# EasyEDA Pro project Project.eprj, board PCB10
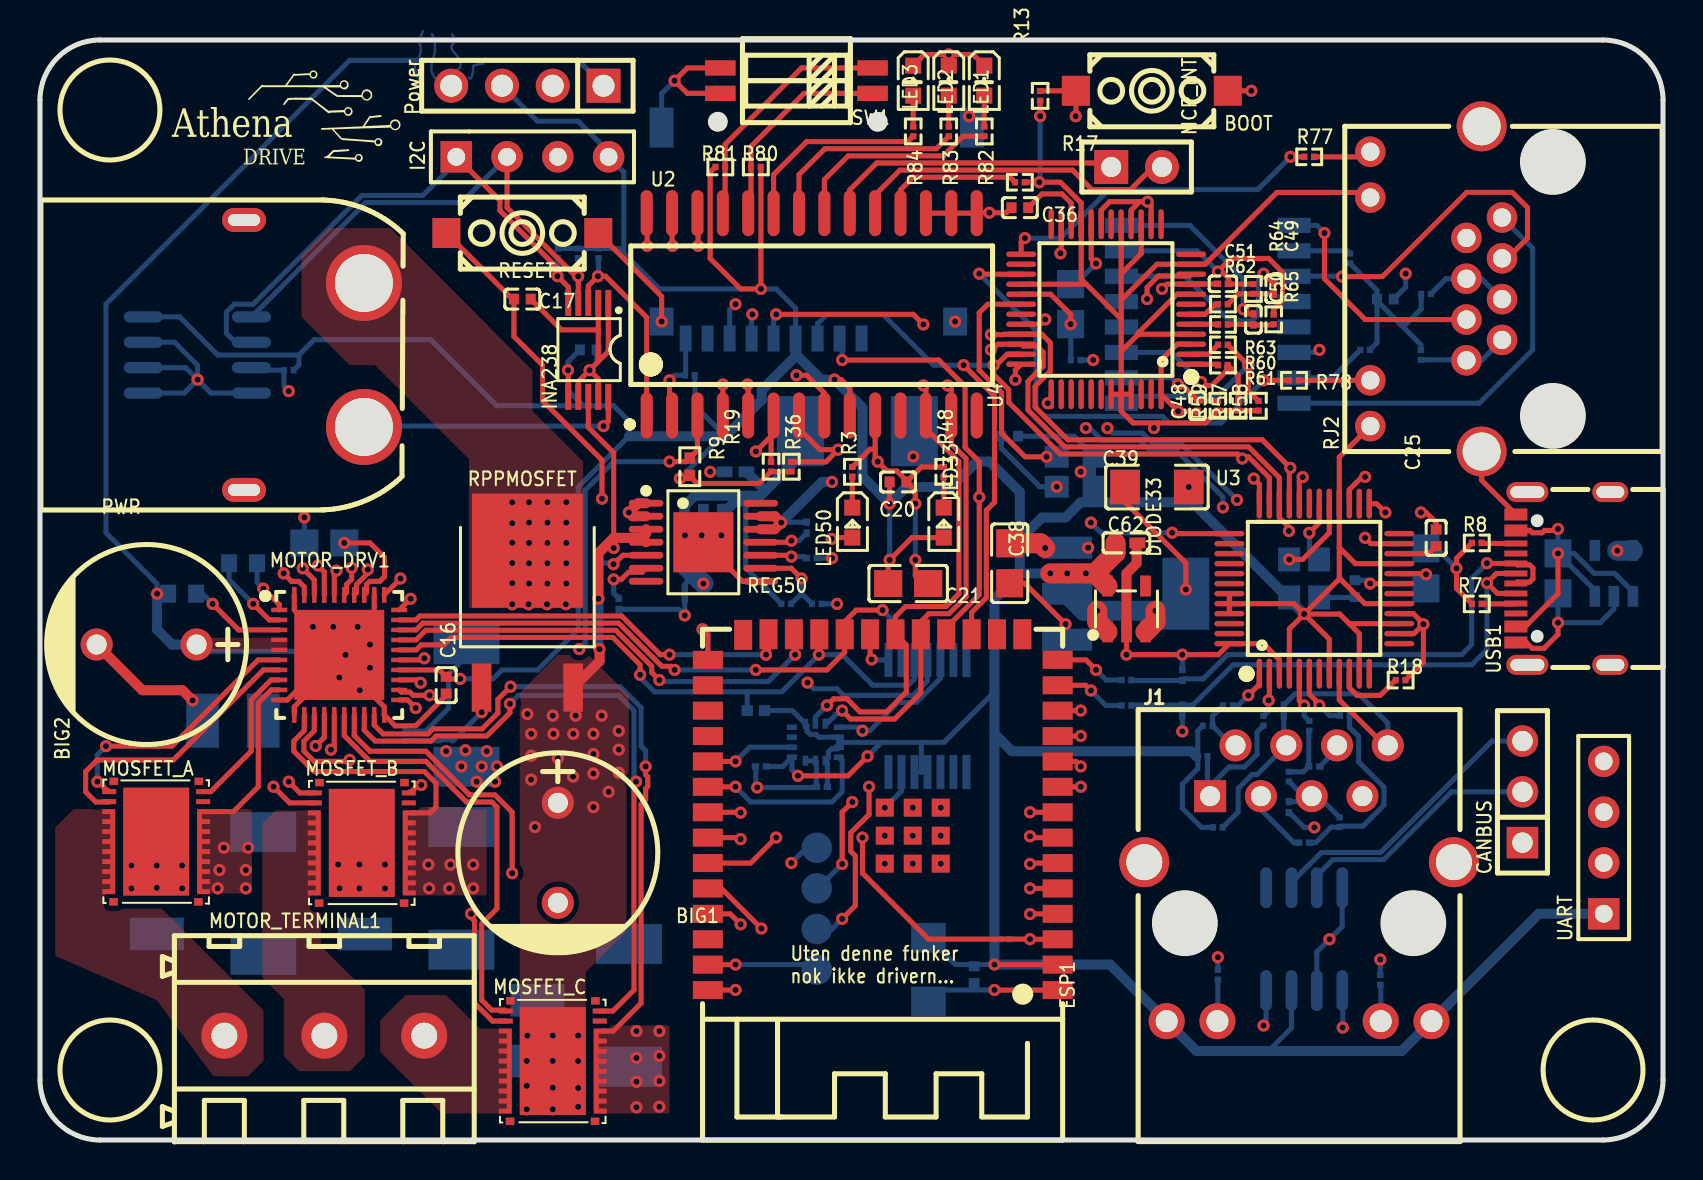
[diagram p7: board, top side]
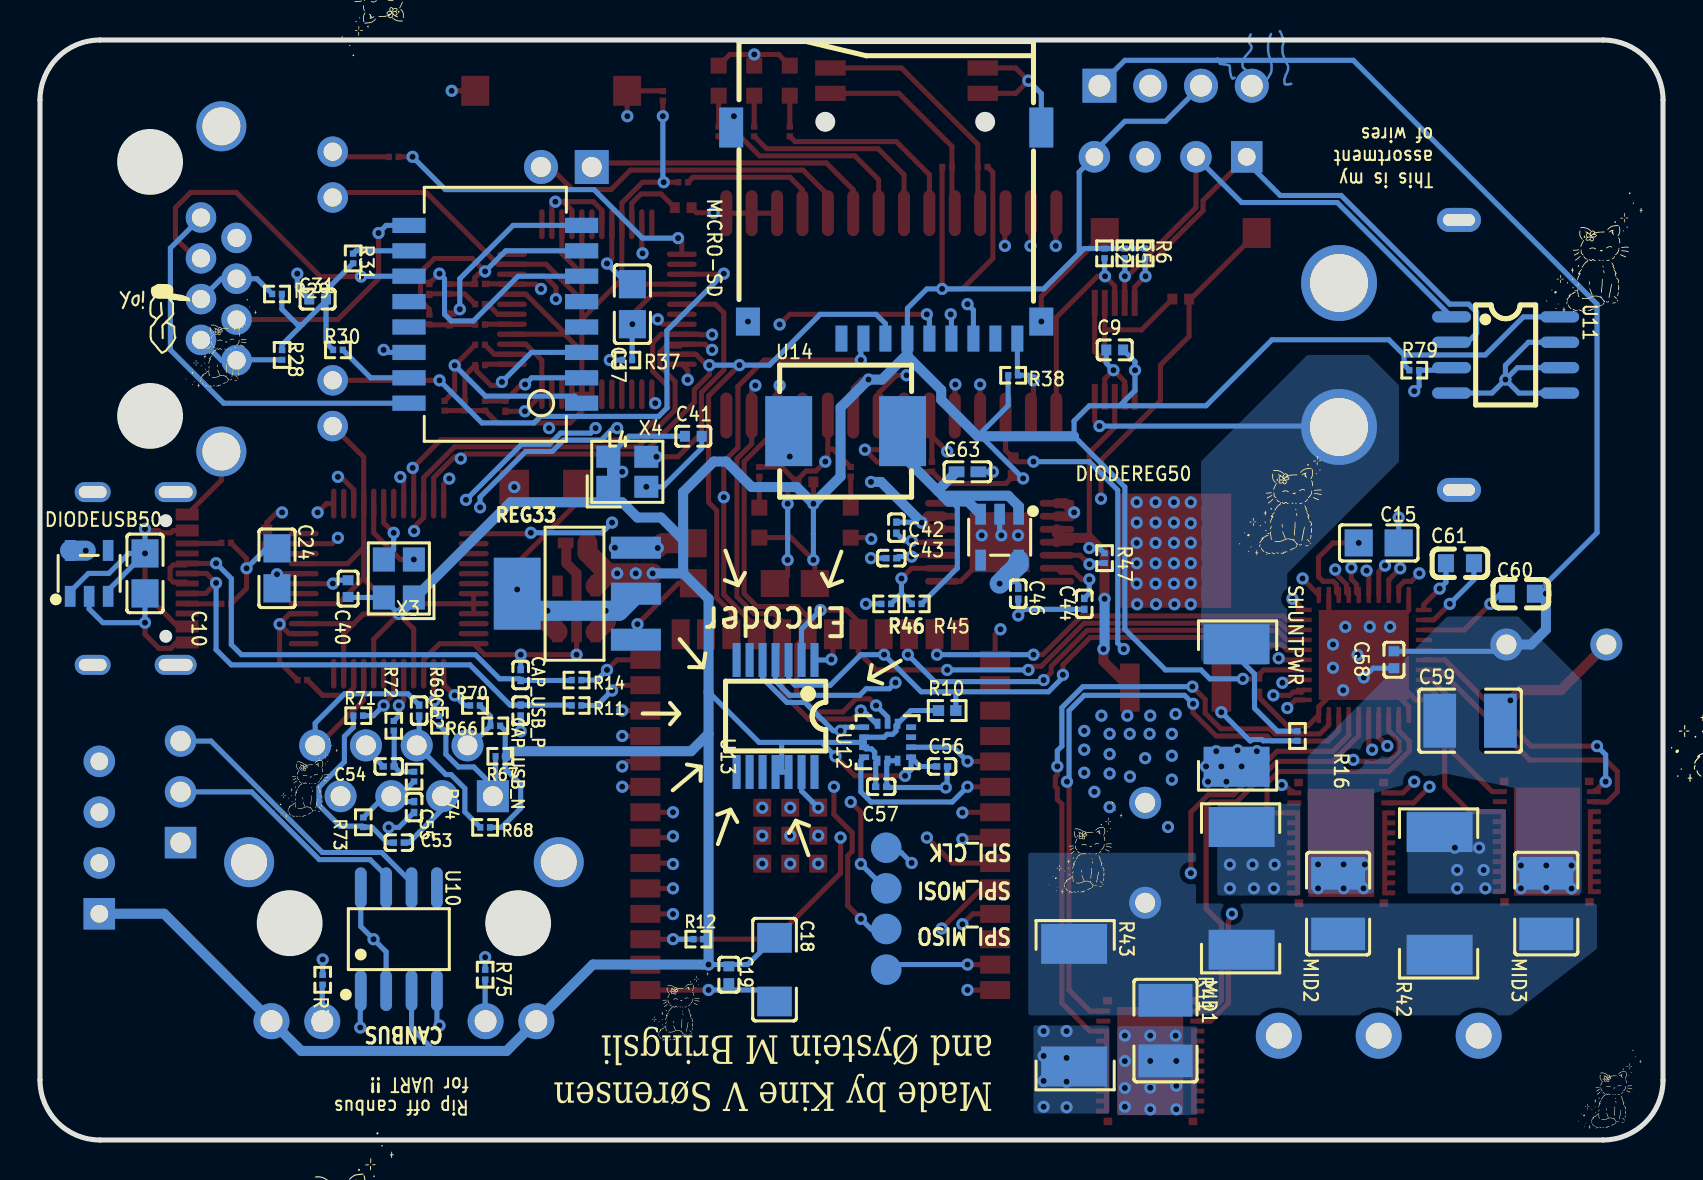
[diagram p8: board, bottom side, seen from below]

Outline 81.2 x 55 mm; copper layers: Top Layer, Inner1, Inner2, Bottom Layer. Coordinates in mm from the lower left corner of the outline.
Outline path: 0,52 0,3 arc(0.88,0.88) 3,0 78.2,0 arc(80.32,0.88) 81.2,3 81.2,52 arc(80.32,54.12) 78.2,55 3,55 arc(0.88,54.12) 0,52
Stack: Top Layer 0.035mm Outer layer thickness 1oz / Dielectric1 0.2104mm 7628 RC49% 8.6mil / Inner1 0.0152mm Inner layer thickness / Dielectric2 1.065mm 1.1mm H/HOZ Copper / Inner2 0.0152mm Inner layer thickness / Dielectric3 0.2104mm 7628 RC49% 8.6mil / Bottom Layer 0.035mm Outer layer thickness 1oz

## Design rules (mm)
template: Custom Config
spacing copperThickness1oz (default): track to track 0.102, other pairs 0.152 to 0.3
spacing copperThickness2oz: track to track 0.203, other pairs 0.152 to 0.3
track width copperThickness1oz (default): min 0.127, default 0.254, max 2.54
track width copperThickness2oz: min 0.203, default 0.254, max 2.54
differential pair differentialPair (default): width min 0.127, default 0.254, max 2.54; gap min 0.152, default 0.152
via viaSize (default): diameter min 0.5, default 0.61, max 10; hole min 0.3, default 0.305, max 6.3
net GND uses copperRegion1
net VIN uses copperRegion1
net $1N21 uses copperRegion1
net $2N31 uses copperRegion1
net $2N36 uses copperRegion1
net $2N29 uses copperRegion1
net $2N24 uses copperRegion1
net $1N52 uses copperRegion1
net $2N4941 uses copperRegion1
net $2N4957 uses copperRegion1

## Placement (name value [footprint] x y rotation side)
BIG1  470uF  [CAP-TH_BD10.0-P5.00-D0.6-FD_2]  25.91 14.36 270 top
BIG2  470uF  [CAP-TH_BD10.0-P5.00-D0.6-FD_2]  5.33 24.77 180 top
BOOT  K2-3.6×6.1_SMD  [KEY-SMD_2P-L6.2-W3.6-LS8.0]  55.63 52.46 0 top
C9  0.1uF  [C0402#2]  27.43 39.51 180 bottom
C10  4.7uF  [C0805]  75.95 28.33 90 bottom
C15  1u  [C0805]  14.22 29.85 180 bottom
C16  0.1uF  [C0402#2]  20.32 22.74 90 top
C17  0.1uF  [C0402#2]  24.13 42.05 180 top
C18  22uF  [C1206]  44.45 8.52 90 bottom
C19  0.1uF  [C0402#2]  46.74 8.26 90 bottom
C20  0.1uF  [C0402#2]  42.93 32.9 180 top
C21  10uF  [C0805]  43.43 27.82 180 top
C24  4.7uF  [C0805]  69.34 28.58 270 bottom
C25  10nF  [C0402#2]  69.85 30.11 270 top
C31  1000pF  [C0402#2]  67.31 42.05 180 bottom
C36  10nF  [C0402#2]  49.02 46.62 0 top
C37  4.7uF  [C0805]  51.56 41.79 90 bottom
C38  10uF  [C0805]  48.51 28.84 90 top
C39  22uF  [C1206]  55.88 32.65 0 top
C40  0.01uF  [C0402#2]  65.79 27.57 90 bottom
C41  0.01uF  [C0402#2]  48.51 35.19 180 bottom
C42  100nF  [C0201]  38.35 30.62 270 bottom
C43  100nF  [C0201]  38.61 29.09 180 bottom
C44  10nF  [C0201]  28.96 26.81 270 bottom
C46  100nF  [C0201]  32.26 27.31 270 bottom
C48  22nF  [C0201]  57.91 36.71 270 top
C49  6.8nF  [C0201]  61.72 42.55 270 top
C50  6.8nF  [C0201]  60.71 41.03 270 top
C51  10nF  [C0201]  59.18 42.81 180 top
C52  22nF  [C0201]  62.23 21.47 90 bottom
C53  6.8nF  [C0201]  63.25 14.87 0 bottom
C54  6.8nF  [C0201]  63.75 18.68 180 bottom
C55  10nF  [C0201]  62.48 16.65 270 bottom
C56  100nF  [C0201]  36.07 18.68 180 bottom
C57  100nF  [C0201]  39.12 17.66 180 bottom
C58  100nF  [C0402#2]  13.46 24.01 270 bottom
C59  10uF  [C1210]  9.65 20.96 180 bottom
C60  1uF  [C0603]  7.11 27.31 0 bottom
C61  47nF  [C0603]  10.16 28.84 180 bottom
C62  15uF  [C0402]  54.36 29.85 0 top
C63  15uF  [C0402]  34.8 33.41 180 bottom
CANBUS  -  [HDR-TH_3P-P2.54-V-F]  74.17 17.41 90 top
CAP_USB_N  NC  [C0201]  57.15 21.47 90 bottom
CAP_USB_P  NC  [C0201]  57.15 23.25 270 bottom
DIODE33  MAX40200AUK+T  [TSOT-23-5_L2.9-W1.6-P0.95-LS2.8-BL]  54.36 26.55 0 top
DIODEREG50  MAX40200AUK+T  [TSOT-23-5_L2.9-W1.6-P0.95-LS2.8-BL]  33.19 30.14 0 bottom
DIODEUSB50  MAX40200AUK+T  [TSOT-23-5_L2.9-W1.6-P0.95-LS2.8-BL]  78.74 28.33 180 bottom
ESP1  ESP32-S3-WROOM-1(N16R8)  [WIRELM-SMD_ESP32-S3-WROOM-1]  42.16 16.39 180 top
I2C  HDR-F-2.54_1x4  [HDR-F-2.54_1X4]  24.64 49.16 0 top
INA238  INA238AIDGSR  [VSSOP-10_L3.0-W3.0-P0.50-LS4.9-BL]  27.43 39.51 180 top
J1  HR911105A  [RJ45-TH_HR911105A]  62.99 12.84 0 top
L4  HX1188NLT  [RJ45-SMD_HX1188NLT]  58.42 41.28 0 bottom
LED1  KT-0603Y  [LED0603-R-RD]  45.47 52.97 270 top
LED2  KT-0603Y  [LED0603-R-RD]  47.24 52.97 270 top
LED3  KT-0603Y  [LED0603-R-RD]  43.69 52.97 270 top
LED33  KT-0603YG  [LED0603-RD]  45.21 30.87 270 top
LED50  KT-0603YG  [LED0603-RD]  40.64 30.87 270 top
MCP_INT  -  [HDR-TH_2P-P2.54-V-F]  54.86 48.65 0 top
MICRO-SD  TF-01A  [TF-SMD_TF-01A]  38.86 45.35 0 bottom
MID1  10uF  [C1210]  24.89 5.47 270 bottom
MID2  10uF  [C1210]  16.26 11.82 90 bottom
MID3  10uF  [C1210]  5.84 11.82 90 bottom
MOSFET_A  CSD88599Q5DC  [SON-22_L5.0-W6.0-P0.50-CSD88599Q5DCT]  5.81 14.92 0 top
MOSFET_B  CSD88599Q5DC  [SON-22_L5.0-W6.0-P0.50-CSD88599Q5DCT]  16.1 14.86 0 top
MOSFET_C  CSD88599Q5DC  [SON-22_L5.0-W6.0-P0.50-CSD88599Q5DCT]  25.65 3.95 0 top
MOTOR_DRV1  DRV8323SRTAR  [WQFN-40_L6.0-W6.0-P0.50-TL-EP4.5]  14.97 24.25 0 top
MOTOR_TERMINAL1  WJ128V-5.0-3P  [CONN-TH_3P-P5.00_WJ128V-5.0-3P]  14.22 5.22 0 top
NOREF  -  [Pad_e1095]  38.86 8.52 0 top
NOREF#2  -  [Pad_e1104]  38.86 14.61 0 top
NOREF#3  -  [Pad_e1105]  38.86 10.55 0 top
NOREF#4  -  [Pad_e1106]  38.86 12.58 0 top
Power  -  [HDR-TH_4P-P2.54-V-F]  24.38 52.71 180 top
PWR  XT60PW-M  [CONN-TH_XT60PW-M]  13.21 39.25 0 top
R2  4.7kΩ  [R0201]  27.94 44.33 90 bottom
R3  330Ω  [R0201]  40.64 33.41 270 top
R5  4.7kΩ  [R0201]  26.92 44.33 90 bottom
R6  4.7kΩ  [R0201]  25.91 44.33 90 bottom
R7  5.1kΩ  [R0201]  71.88 26.81 180 top
R8  5.1kΩ  [R0201]  71.88 29.85 180 top
R9  50kΩ  [R0402]  32.51 33.66 90 top
R10  50kΩ  [R0402]  35.81 21.47 180 bottom
R11  0Ω  [R0201]  54.36 21.73 180 bottom
R12  10kΩ  [R0201]  48.26 10.04 180 bottom
R13  10kΩ  [R0201]  50.04 52.21 270 top
R14  0Ω  [R0201]  54.36 23 180 bottom
R16  100kΩ  [R0201]  18.29 20.2 90 bottom
R17  1kΩ  [R0201]  49.02 47.89 180 top
R18  12.4kΩ  [R0201]  68.07 23 0 top
R19  10kΩ  [R0201]  36.58 33.66 270 top
R28  75Ω  [R0201]  69.09 39.25 270 bottom
R29  75Ω  [R0201]  69.34 42.3 0 bottom
R30  75Ω  [R0201]  66.29 39.51 180 bottom
R31  75Ω  [R0201]  65.53 44.08 90 bottom
R36  10kΩ  [R0201]  37.59 33.66 270 top
R37  12.4kΩ  [R0201]  51.82 39 180 bottom
R38  10kΩ  [R0201]  32.51 38.24 0 bottom
R41  3.5mΩ  [RES-SMD_L6.4-W3.2-R2512]  21.08 12.58 90 bottom
R42  3.5mΩ  [RES-SMD_L6.4-W3.2-R2512]  11.18 12.33 90 bottom
R43  3.5mΩ  [RES-SMD_L6.4-W3.2-R2512]  29.46 6.74 270 bottom
R45  15K  [R0201]  37.34 26.81 180 bottom
R46  10K  [R0201]  38.86 26.81 180 bottom
R47  100K  [R0201]  27.94 29.09 270 bottom
R48  110Ω  [R0201]  45.21 33.41 270 top
R57  49.9R  [R0201]  59.94 36.71 270 top
R58  49.9R  [R0201]  60.96 36.71 270 top
R59  10R  [R0201]  58.93 36.71 270 top
R60  33R  [R0201]  59.18 39.76 0 top
R61  33R  [R0201]  59.18 38.74 0 top
R62  33R  [R0201]  59.18 41.79 0 top
R63  33R  [R0201]  59.18 40.78 0 top
R64  82R  [R0201]  60.71 42.55 270 top
R65  82R  [R0201]  61.72 41.03 270 top
R66  49.9R  [R0201]  58.42 20.71 180 bottom
R67  49.9R  [R0201]  58.17 19.19 180 bottom
R68  10R  [R0201]  58.93 15.63 180 bottom
R69  33R  [R0201]  61.21 20.96 270 bottom
R70  33R  [R0201]  59.44 21.73 180 bottom
R71  33R  [R0201]  65.28 21.22 0 bottom
R72  33R  [R0201]  63.5 20.71 270 bottom
R73  82R  [R0201]  65.02 15.88 270 bottom
R74  82R  [R0201]  62.48 18.17 90 bottom
R75  330  [R0201]  58.93 8.26 270 bottom
R76  330  [R0201]  67.06 8.01 270 bottom
R77  330  [R0201]  63.5 49.16 0 top
R78  330  [R0201]  62.74 37.98 180 top
R79  200K  [R0201]  12.45 38.49 180 bottom
R80  10K  [R0201]  35.81 48.65 0 top
R81  10K  [R0201]  34.04 48.65 180 top
R82  200  [R0201]  47.24 50.43 90 top
R83  200  [R0201]  45.47 50.43 90 top
R84  200  [R0201]  43.69 50.43 90 top
REG33  AMS1117-3.3  [SOT-223-3_L6.5-W3.4-P2.30-LS7.0-BR]  54.36 27.31 180 bottom
REG50  LM5161PWPR  [HTSSOP-14_L5.0-W4.4-P0.65-LS6.4-BL-EP3.0]  33.19 29.89 270 top
RESET  K2-3.6×6.1_SMD  [KEY-SMD_2P-L6.2-W3.6-LS8.0]  24.13 45.35 180 top
RJ2  R-RJ45R08P-C000  [RJ45-TH_R-RJ45R08P-C000]  69.85 42.55 90 top
RPPMOSFET  SQD50P06-15L_GE3  [TO-252-2_L6.6-W6.1-P4.58-LS9.9-BR]  24.38 26.04 270 top
SHUNTPWR  3.5mΩ  [RES-SMD_L6.4-W3.2-R2512]  21.34 21.73 270 bottom
SW1  DSHP02TSGET  [SW-SMD_4P_DSHP02TSGET]  37.85 52.97 90 top
U2  MCP23017-E/SO  [SOIC-28_L18.0-W7.5-P1.27-LS10.3-BL]  38.61 41.28 0 top
U3  W5500  [LQFP-48_L7.0-W7.0-P0.50-LS9.0-BL]  63.75 27.57 0 top
U4  W5500  [LQFP-48_L7.0-W7.0-P0.50-LS9.0-BL]  53.34 41.54 90 top
U10  SN65HVD230DR  [SOIC-8_L4.9-W3.9-P1.27-LS6.0-BL]  63.25 10.04 180 bottom
U11  LM75AD,118  [SOIC-8_L5.0-W4.0-P1.27-LS6.0-BL]  7.87 39.25 270 bottom
U12  LSM6DSOWTR  [LGA-14L_L3.0-W2.5-P0.50-TL]  38.79 19.89 180 bottom
U13  AS5047P-ATSM  [TSSOP-14_L5.0-W4.4-P0.65-LS6.4-BL]  44.4 21.2 0 bottom
U14  68uH  [IND-SMD_L7.2-W6.6_GPSR07X0]  40.89 35.44 180 bottom
UART  HDR-F-2.54_1x4  [HDR-F-2.54_1X4]  78.23 15.12 90 top
USB1  TYPE-C16PIN  [USB-C-SMD_TYPE-C16PIN]  76.2 28.08 90 top
X3  25MHz  [OSC-SMD_4P-L2.5-W2.0-BL]  63.25 28.08 90 bottom
X4  25MHz  [OSC-SMD_4P-L2.5-W2.0-BL]  51.82 33.41 180 bottom

## Footprints (pads in the part's own frame, mm; a bottom-side part is the same pattern mirrored in y, then rotated)
C0201
  rect 0.368x0.324 smd: 1(-0.275,0) 2(0.275,0)
C0402
  rect 0.79x0.54 smd: 1(-0.545,0) 2(0.545,0)
C0402#2
  rect 0.5x0.54 smd: 1(-0.42,0) 2(0.42,0)
C0603
  rect 0.8x0.9 smd: 1(-0.7,0) 2(0.7,0)
C0805
  rect 1.41x1.35 smd: 1(-1,0) 2(1,0)
C1206
  rect 1.485x1.728 smd: 1(-1.593,0) 2(1.593,0)
C1210
  rect 1.635x2.7 smd: 1(-1.518,0) 2(1.518,0)
CAP-TH_BD10.0-P5.00-D0.6-FD_2
  round 1.6 hole 1: 1(-2.5,0) 2(2.5,0)
CONN-TH_3P-P5.00_WJ128V-5.0-3P
  round 2.3 hole 1.3: 1(-5,0) 2(0.003,0) 3(5,0)
CONN-TH_XT60PW-M
  round 3.8 hole 2.9: 1(3,-3.6) 2(3,3.6)
  oval 2.2x1.2 hole 1.6x0.6: 3(-3,6.75) 4(-3,-6.75)
HDR-F-2.54_1X4
  rect 1.575x1.575 hole 0.889: 1(-3.81,0)
  round 1.575 hole 0.889: 2(-1.27,0) 3(1.27,0) 4(3.81,0)
HDR-TH_2P-P2.54-V-F
  rect 1.7x1.7 hole 1: 1(-1.27,0)
  round 1.7 hole 1: 2(1.27,0)
HDR-TH_3P-P2.54-V-F
  rect 1.575x1.575 hole 1.02: 1(-2.54,0)
  round 1.575 hole 1.02: 2(0,0) 3(2.54,0)
HDR-TH_4P-P2.54-V-F
  rect 1.7x1.7 hole 1.1: 1(-3.81,0)
  round 1.7 hole 1.1: 2(-1.27,0) 3(1.27,0) 4(3.81,0)
HTSSOP-14_L5.0-W4.4-P0.65-LS6.4-BL-EP3.0
  oval 0.343x1.732 smd: 1(-1.95,-2.866) 2(-1.3,-2.866) 3(-0.65,-2.866) 4(0,-2.866) 5(0.65,-2.866) 6(1.3,-2.866) 7(1.95,-2.866) 8(1.95,2.866) 9(1.3,2.866) 10(0.65,2.866) 11(0,2.866) 12(-0.65,2.866) 13(-1.3,2.866) 14(-1.95,2.866)
  rect 3x3 smd: 15(0,0)
IND-SMD_L7.2-W6.6_GPSR07X0
  rect 2.35x3.5 smd: 1(-2.85,0) 2(2.85,0)
KEY-SMD_2P-L6.2-W3.6-LS8.0
  rect 1.4x1.5 smd: 1(-3.8,0) 2(3.8,0)
LED0603-R-RD
  rect 0.8x0.8 smd: 1(0.751,0) 2(-0.751,0)
LED0603-RD
  rect 0.8x0.8 smd: 1(-0.749,0) 2(0.749,0)
LGA-14L_L3.0-W2.5-P0.50-TL
  rect 0.5x0.28 smd: 1(-1.175,0.75) 2(-1.175,0.25) 3(-1.175,-0.25) 4(-1.175,-0.75) 8(1.175,-0.75) 9(1.175,-0.25) 10(1.175,0.25) 11(1.175,0.75)
  rect 0.28x0.5 smd: 5(-0.5,-0.925) 6(0,-0.925) 7(0.5,-0.925) 12(0.5,0.925) 13(0,0.925) 14(-0.5,0.925)
LQFP-48_L7.0-W7.0-P0.50-LS9.0-BL
  oval 0.27x1.5 smd: 1(-2.75,-4.25) 2(-2.25,-4.25) 3(-1.75,-4.25) 4(-1.25,-4.25) 5(-0.75,-4.25) 6(-0.25,-4.25) 7(0.25,-4.25) 8(0.75,-4.25) 9(1.25,-4.25) 10(1.75,-4.25) 11(2.25,-4.25) 12(2.75,-4.25) 25(2.75,4.25) 26(2.25,4.25) 27(1.75,4.25) 28(1.25,4.25) 29(0.75,4.25) 30(0.25,4.25) 31(-0.25,4.25) 32(-0.75,4.25) 33(-1.25,4.25) 34(-1.75,4.25) 35(-2.25,4.25) 36(-2.75,4.25)
  oval 1.5x0.27 smd: 13(4.25,-2.75) 14(4.25,-2.25) 15(4.25,-1.75) 16(4.25,-1.25) 17(4.25,-0.75) 18(4.25,-0.25) 19(4.25,0.25) 20(4.25,0.75) 21(4.25,1.25) 22(4.25,1.75) 23(4.25,2.25) 24(4.25,2.75) 37(-4.25,2.75) 38(-4.25,2.25) 39(-4.25,1.75) 40(-4.25,1.25) 41(-4.25,0.75) 42(-4.25,0.25) 43(-4.25,-0.25) 44(-4.25,-0.75) 45(-4.25,-1.25) 46(-4.25,-1.75) 47(-4.25,-2.25) 48(-4.25,-2.75)
OSC-SMD_4P-L2.5-W2.0-BL
  rect 1.2x1.1 smd: 1(-0.95,-0.75) 2(0.95,-0.75) 3(0.95,0.75) 4(-0.95,0.75)
Pad_e1095
  round 1.524 smd far side: 1(0,0)
Pad_e1104
  round 1.524 smd far side: 1(0,0)
Pad_e1105
  round 1.524 smd far side: 2(0,0)
Pad_e1106
  round 1.524 smd far side: 3(0,0)
R0201
  rect 0.303x0.324 smd: 1(-0.241,0) 2(0.241,0)
R0402
  rect 0.566x0.54 smd: 1(-0.433,0) 2(0.433,0)
RES-SMD_L6.4-W3.2-R2512
  rect 2x3.3 smd: 1(-3.067,0) 2(3.067,0)
RJ45-SMD_HX1188NLT
  rect 1.66x0.76 smd: 1(-4.318,4.445) 2(-4.318,3.175) 3(-4.318,1.905) 4(-4.318,0.635) 5(-4.318,-0.635) 6(-4.318,-1.905) 7(-4.318,-3.175) 8(-4.318,-4.445) 9(4.318,-4.445) 10(4.318,-3.175) 11(4.318,-1.905) 12(4.318,-0.635) 13(4.318,0.635) 14(4.318,1.905) 15(4.318,3.175) 16(4.318,4.445)
RJ45-TH_HR911105A
  rect 1.6x1.6 hole 1: 1(-4.45,4.355)
  round 1.6 hole 1: 2(-3.18,6.895) 3(-1.91,4.355) 4(-0.64,6.895) 5(0.63,4.355) 6(1.9,6.895) 7(3.17,4.355) 8(4.44,6.895)
  round 1.8 hole 1.1: 9(-6.625,-6.895) 10(-4.085,-6.895) 11(4.085,-6.895) 12(6.625,-6.895)
  round 2.5 hole 1.8: SH1(-7.745,1.055) SH2(7.745,1.055)
RJ45-TH_R-RJ45R08P-C000
  round 1.524 hole 0.914: 1(3.57,-3.295) 2(2.55,-1.515) 3(1.53,-3.295) 4(0.51,-1.515) 5(-0.51,-3.295) 6(-1.53,-1.515) 7(-2.55,-3.295) 8(-3.57,-1.515) 9(-6.86,3.295) 10(-4.57,3.295) 11(4.57,3.295) 12(6.86,3.295)
  round 2.5 hole 1.9: 13(8.13,-2.275) 14(-8.13,-2.275)
SOIC-8_L4.9-W3.9-P1.27-LS6.0-BL
  oval 0.588x2.045 smd: 1(-1.905,-2.57) 2(-0.635,-2.57) 3(0.635,-2.57) 4(1.905,-2.57) 5(1.905,2.57) 6(0.635,2.57) 7(-0.635,2.57) 8(-1.905,2.57)
SOIC-8_L5.0-W4.0-P1.27-LS6.0-BL
  oval 0.569x1.95 smd: 1(-1.905,-2.705) 2(-0.635,-2.705) 3(0.635,-2.705) 4(1.905,-2.705) 5(1.905,2.705) 6(0.635,2.705) 7(-0.635,2.705) 8(-1.905,2.705)
SOIC-28_L18.0-W7.5-P1.27-LS10.3-BL
  oval 0.6x2.3 smd: 1(-8.255,-5.058) 2(-6.985,-5.058) 3(-5.715,-5.058) 4(-4.445,-5.058) 5(-3.175,-5.058) 6(-1.905,-5.058) 7(-0.635,-5.058) 8(0.635,-5.058) 9(1.905,-5.058) 10(3.175,-5.058) 11(4.445,-5.058) 12(5.715,-5.058) 13(6.985,-5.058) 14(8.255,-5.058) 15(8.255,5.058) 16(6.985,5.058) 17(5.715,5.058) 18(4.445,5.058) 19(3.175,5.058) 20(1.905,5.058) 21(0.635,5.058) 22(-0.635,5.058) 23(-1.905,5.058) 24(-3.175,5.058) 25(-4.445,5.058) 26(-5.715,5.058) 27(-6.985,5.058) 28(-8.255,5.058)
SON-22_L5.0-W6.0-P0.50-CSD88599Q5DCT
  rect 0.7x0.25 smd: 1(-2.35,2.5) 2(-2.35,2) 21(2.35,2) 22(2.35,2.5)
  rect 0.45x0.25 smd: 3(-2.475,1.5) 4(-2.475,1) 5(-2.475,0.5) 6(-2.475,0) 7(-2.475,-0.5) 8(-2.475,-1) 9(-2.475,-1.5) 10(-2.475,-2) 11(-2.475,-2.5) 12(2.475,-2.5) 13(2.475,-2) 14(2.475,-1.5) 15(2.475,-1) 16(2.475,-0.5) 17(2.475,0) 18(2.475,0.5) 19(2.475,1) 20(2.475,1.5)
  rect 0.25x4.25 smd: 11(-2.175,-0.5) 20(2.175,-0.5)
  rect 0.43x0.375 smd: 23(-2.115,3.013) 24(-2.135,-3.013) 25(2.115,-3.013) 26(2.135,3.013)
  rect 3.3x5.4 smd: 27(0,0)
SOT-223-3_L6.5-W3.4-P2.30-LS7.0-BR
  rect 2.5x1.1 smd: 1(2.97,-2.3) 2(2.97,0) 3(2.97,2.3)
  rect 2.34x3.6 smd: 4(-2.97,0)
SW-SMD_4P_DSHP02TSGET
  rect 0.762x1.524 smd: 1(-0.635,-3.81) 2(0.635,-3.81) 3(0.635,3.81) 4(-0.635,3.81)
TF-SMD_TF-01A
  rect 0.6x1.3 smd: 1(2.24,5.276) 2(1.14,5.276) 3(0.04,5.276) 4(-1.06,5.276) 5(-2.16,5.276) 6(-3.26,5.276) 7(-4.36,5.276) 8(-5.46,5.276) 9(-6.56,5.276)
  rect 1.2x1.4 smd: 10(-7.76,4.426) 13(6.92,4.426)
  rect 1.2x2 smd: 11(-7.76,-5.276) 12(7.76,-5.276)
TO-252-2_L6.6-W6.1-P4.58-LS9.9-BR
  rect 2.409x0.979 smd: 1(3.424,-2.29) 3(3.424,2.29)
  rect 5.711x5.548 smd: 2(-3.424,0)
TSOT-23-5_L2.9-W1.6-P0.95-LS2.8-BL
  rect 0.532x1.045 smd: 1(-0.95,-1.147) 2(0,-1.147) 3(0.95,-1.147) 4(0.95,1.147) 5(-0.95,1.147)
TSSOP-14_L5.0-W4.4-P0.65-LS6.4-BL
  rect 0.4x1.7 smd: 1(-1.95,-2.8) 2(-1.3,-2.8) 3(-0.65,-2.8) 4(0,-2.8) 5(0.65,-2.8) 6(1.3,-2.8) 7(1.95,-2.8) 8(1.95,2.8) 9(1.3,2.8) 10(0.65,2.8) 11(0,2.8) 12(-0.65,2.8) 13(-1.3,2.8) 14(-1.95,2.8)
USB-C-SMD_TYPE-C16PIN
  oval 1x2.1 hole 0.6x1.7: 1(-4.32,1.788) 2(4.32,1.788)
  oval 1x1.8 hole 0.6x1.4: 3(-4.32,-2.362) 4(4.32,-2.362)
  rect 0.6x1.15 smd: A1B12(-3.2,2.362) A4B9(-2.4,2.362) B1A12(3.2,2.362) B4A9(2.4,2.362)
  rect 0.3x1.15 smd: A5(-1.25,2.362) A6(-0.25,2.362) A7(0.25,2.362) A8(1.25,2.362) B5(1.75,2.362) B6(0.75,2.362) B7(-0.75,2.362) B8(-1.75,2.362)
VSSOP-10_L3.0-W3.0-P0.50-LS4.9-BL
  rect 0.3x1.3 smd: 1(-1,-2.35) 2(-0.5,-2.35) 3(0,-2.35) 4(0.5,-2.35) 5(1,-2.35) 6(1,2.35) 7(0.5,2.35) 8(0,2.35) 9(-0.5,2.35) 10(-1,2.35)
WIRELM-SMD_ESP32-S3-WROOM-1
  rect 1.5x0.9 smd: 1(-8.75,8.895) 2(-8.75,7.625) 3(-8.75,6.355) 4(-8.75,5.085) 5(-8.75,3.815) 6(-8.75,2.545) 7(-8.75,1.275) 8(-8.75,0.005) 9(-8.75,-1.265) 10(-8.75,-2.535) 11(-8.75,-3.805) 12(-8.75,-5.075) 13(-8.75,-6.345) 14(-8.75,-7.615) 27(8.75,-7.615) 28(8.75,-6.345) 29(8.75,-5.075) 30(8.75,-3.805) 31(8.75,-2.535) 32(8.75,-1.265) 33(8.75,0.005) 34(8.75,1.275) 35(8.75,2.545) 36(8.75,3.815) 37(8.75,5.085) 38(8.75,6.355) 39(8.75,7.625) 40(8.75,8.895)
  rect 0.9x1.5 smd: 15(-6.985,-8.895) 16(-5.715,-8.895) 17(-4.445,-8.895) 18(-3.175,-8.895) 19(-1.905,-8.895) 20(-0.635,-8.895) 21(0.635,-8.895) 22(1.905,-8.895) 23(3.175,-8.895) 24(4.445,-8.895) 25(5.715,-8.895) 26(6.985,-8.865)
  rect 0.9x0.9 smd: 41(-2.9,2.575) 41(-2.9,1.175) 41(-2.9,-0.225) 41(-1.5,2.575) 41(-1.5,1.175) 41(-1.5,-0.225) 41(-0.1,2.575) 41(-0.1,1.175) 41(-0.1,-0.225)
WQFN-40_L6.0-W6.0-P0.50-TL-EP4.5
  rect 0.8x0.22 smd: 1(-3,2.25) 2(-3,1.75) 3(-3,1.25) 4(-3,0.75) 5(-3,0.25) 6(-3,-0.25) 7(-3,-0.75) 8(-3,-1.25) 9(-3,-1.75) 10(-3,-2.25) 21(3,-2.25) 22(3,-1.75) 23(3,-1.25) 24(3,-0.75) 25(3,-0.25) 26(3,0.25) 27(3,0.75) 28(3,1.25) 29(3,1.75) 30(3,2.25)
  rect 0.22x0.8 smd: 11(-2.25,-3) 12(-1.75,-3) 13(-1.25,-3) 14(-0.75,-3) 15(-0.25,-3) 16(0.25,-3) 17(0.75,-3) 18(1.25,-3) 19(1.75,-3) 20(2.25,-3) 31(2.25,3) 32(1.75,3) 33(1.25,3) 34(0.75,3) 35(0.25,3) 36(-0.25,3) 37(-0.75,3) 38(-1.25,3) 39(-1.75,3) 40(-2.25,3)
  rect 4.5x4.5 smd: 41(0,0)

## Nets
As in the schematic, except:
SPI_CLK_0: ESP1.22 MOTOR_DRV1.28 NOREF#2.1 U13.2
SPI_MISO_0: ESP1.23 MOTOR_DRV1.26 NOREF#3.2 R10.2 U13.3
SPI_MOSI_0: ESP1.24 MOTOR_DRV1.27 NOREF#4.3 U13.4
$2N24: MOSFET_C.12 MOSFET_C.13 MOSFET_C.14 MOSFET_C.15 MOSFET_C.16 MOSFET_C.17 MOSFET_C.18 MOSFET_C.19 MOSFET_C.20 MOTOR_DRV1.19 R43.2
$2N25: MOSFET_C.1 MOTOR_DRV1.16
$2N26: MOSFET_B.1 MOTOR_DRV1.15
$2N27: MOSFET_B.2 MOTOR_DRV1.14
$2N28: MOSFET_B.22 MOTOR_DRV1.13
$2N29: MOSFET_B.12 MOSFET_B.13 MOSFET_B.14 MOSFET_B.15 MOSFET_B.16 MOSFET_B.17 MOSFET_B.18 MOSFET_B.19 MOSFET_B.20 MOTOR_DRV1.12 R41.2
$2N31: MOSFET_A.12 MOSFET_A.13 MOSFET_A.14 MOSFET_A.15 MOSFET_A.16 MOSFET_A.17 MOSFET_A.18 MOSFET_A.19 MOSFET_A.20 MOTOR_DRV1.9 R42.2
$2N32: MOSFET_A.22 MOTOR_DRV1.8
$2N33: MOSFET_A.2 MOTOR_DRV1.7
$2N34: MOSFET_A.1 MOTOR_DRV1.6
$2N47: MOSFET_C.2 MOTOR_DRV1.17
$2N48: MOSFET_C.22 MOTOR_DRV1.18
$3N12760: ESP1.39 NOREF.1

Pads without a net: DIODE33 4; DIODEREG50 4; DIODEUSB50 4; ESP1 16 26 28 29 30; J1 7; L4 4 5 12 13; MICRO-SD 1 8; MOSFET_A 21 23 24 25 26; MOSFET_B 21 23 24 25 26; MOSFET_C 21 23 24 25 26; PWR 3 4; REG50 7 14; U2 11 14; U3 7 12 13 18 24 26 31 38 39 40 41 42 46 47; U4 7 12 13 18 24 26 31 38 39 40 41 42 46 47; U10 5; U12 10 11; U13 6 7 8 9 10 14; USB1 1 2 3 4 A8 B8

## Via types
v1: diameter 0.61, hole 0.305, Top Layer to Bottom Layer, 346 vias

## Routing (per net, layer and track width the routed paths; a pad name or vN(x,y) marks a point on that pad's centre or on a via; arc(x,y) is an arc through that point)
3V3: length 395.3
  Top Layer w0.254: R81.2 33.53,48.38 33.53,44.08 35.05,42.55 v1(36.07,42.55) 36.07,48.64 R80.2 ; 54.09,41.04 54.09,39.43 ; 54.09,41.04 54.09,42 ; 54.09,41.04 52.34,42.79 ; 54.09,39.43 U4.44 ; 54.09,39.43 54.95,40.29 ; U3.15 65.5,25.82 ; 65.5,25.82 66,25.32 U3.11 ; 65.5,25.82 65.02,26.3 v1(63.25,26.3) ; U4.8 56.88,42.29 54.95,40.35 54.95,40.29 ; ESP1.2 47.76,8.77 v1(47.75,8.77) ; v1(39.75,38.02) 40.09,38.02 40.51,37.6 U2.9 ; 65,29.62 U3.28 65,34.14 RJ2.9 ; 65,29.62 65,28.1 ; 65,29.62 65.81,28.82 U3.21 ; U3.44 62.73,26.82 v1(63.25,26.3) ; U3.44 U3.45 ; U3.44 U3.43 ; U3.4 62.5,25.56 v1(63.25,26.3) ; 65,28.1 65,28.06 v1(63.25,26.3) ; 65,28.1 66.28,26.82 U3.17 ; 54.09,43.32 55.09,44.32 U4.15 ; 54.09,43.32 54.09,42 ; 54.09,43.32 U4.17 ; v1(63.25,26.3) 64.5,25.04 U3.8 ; U4.44 54.09,36.45 54.68,35.85 55.98,35.85 ; U4.44 U4.43 ; U4.44 U4.45 ; 45.21,30.12 43.63,30.12 v1(42.51,29) 42.43,28.93 42.43,27.57 ; 54.09,42 55.88,43.79 U4.11 58.29,43.79 61.88,47.38 66.3,47.38 RJ2.11 ; R58.2 R57.2 R59.2 58.31,35.85 55.98,35.85 ; 55.98,35.85 55.98,35.84 v1(55.73,35.6) ; R17.1 v1(49.99,47.89) 51.05,47.89 52.09,46.85 U4.21 52.09,43.04 52.34,42.79 ; 54.95,40.29 U4.4 ; R13.2 v1(50.04,51.19) ; v1(26.42,38.49) 26.43,38.47 INA238.6 ; v1(41.4,19.19) 40.43,18.21 v1(37.92,18.21) ; 52.34,42.79 U4.28 ; v1(32.01,33.08) 32.36,33.08 R9.1 32.51,33.19 32.88,32.83 35.98,32.83 R19.2 R36.2 ; C20.2 42.51,31.81 ; MOTOR_DRV1.24 19.98,23.5 C16.2 20.43,23.06 v1(21.02,23.06)
  Top Layer w1: 52.78,28.33 53.81,29.37 C62.1 ; 52.78,28.33 v1(52.32,28.33) v1(51.39,28.33) v1(50.55,28.33) ; 52.78,28.33 DIODE33.5
  Inner2 w0.254: v1(52.07,33.41) 53.54,33.41 v1(55.73,35.6)
  Bottom Layer w0.254: 29.21,44.33 30.99,42.55 v1(36.07,42.55) 36.83,42.55 37.8,41.58 MICRO-SD.4 ; 29.21,44.33 29.21,48.4 I2C.4 28.45,49.41 26.92,50.94 24.89,50.94 Power.3 ; 29.21,44.33 28.97,44.57 R2.2 R5.2 R6.2 ; 42.1,19.88 44.1,19.88 ; 42.1,19.88 39.97,19.88 ; 42.1,19.88 v1(41.4,19.19) ; 44.1,19.88 45.22,19.88 47.75,22.41 ; 44.1,19.88 44.1,18.41 44.09,18.4 ; C56.1 37.16,18.68 U12.8 37.62,18.51 v1(37.92,18.21) ; v1(49.99,47.89) 50.04,47.93 v1(50.04,51.19) ; 27.18,36.71 22.86,36.71 19.56,40.01 13.72,40.01 12.95,39.25 ; 27.18,36.71 26.42,37.47 v1(26.42,38.49) 26.42,38.91 C9.2 ; 27.18,36.71 28.7,36.71 29.46,35.95 29.46,35.19 26.92,32.65 26.92,25.54 24.89,23.5 23.11,23.5 22.67,23.06 v1(21.02,23.06) ; R38.2 32.77,38.22 32.77,36.71 34.29,35.19 ; U11.8 6.98,41.16 8.89,39.25 12.95,39.25 ; 61.47,4.45 62.61,5.6 U10.3 ; X4.4 51.74,35.19 C41.1 ; 12.95,39.25 12.95,38.76 R79.1 ; v1(32.01,33.08) 34.12,35.19 ; 39.97,19.88 39.97,19.64 39.89,19.56 39.6,19.56 39.44,19.39 39.44,19.11 U12.5 39.39,18.87 C57.1 ; 39.97,19.88 39.97,20.14 38.97,20.14 38.82,20.28 38.54,20.28 38.37,20.45 38.37,20.73 U12.12 37.64,21.47 R10.1 ; C18.2 45.79,8.77 v1(47.75,8.77) ; R66.2 57.92,20.46 R67.2 57.92,18.57 57.15,17.79 57.15,16.59 58.11,15.63 R68.2 ; C40.1 65.76,27.13 X3.4 64,27.05 v1(63.25,26.3) ; 44.09,18.4 U13.12 ; 44.09,18.4 U13.11 ; v1(42.51,29) 42.51,30.29 42.5,30.3 42.51,30.31 v1(42.51,31.81)
  Bottom Layer w0.5: UART.1 74.99,11.31 J1.12 68.13,4.45 57.85,4.45 J1.9 53.54,8.77 v1(47.75,8.77) 47.75,20.31 ; 29.46,35.19 34.29,35.19 36.11,37.01 36.11,37.5 37.8,39.19 37.8,39.3 ; 57.85,19.19 57.6,19.44 48.62,19.44 47.75,20.31 ; 47.75,20.31 47.75,27.06 49.02,28.33 ; 37.8,39.3 39.08,38.02 v1(39.75,38.02) 41.15,36.62 41.15,33.17 v1(42.51,31.81) 43.34,32.65 45.59,32.65 46.87,33.92 47.49,33.92 49.02,32.39 49.02,30.02 ; 37.8,39.3 MICRO-SD.4 ; 49.02,28.33 49.02,30.02 ; 49.02,28.33 v1(50.55,28.33) ; 49.02,30.02 50.13,31.12 51.31,31.12 52.07,31.89 52.58,31.89 ; 52.58,31.89 57.66,31.89 v1(63.25,26.3) ; 52.58,31.89 52.58,33.97
5V0: length 141.4
  Top Layer w0.254: 40.64,30.12 39.68,30.12 v1(39.61,30.05)
  Top Layer w1: C38.2 50.05,29.84 v1(50.29,29.6)
  Inner2 w0.254: v1(39.61,30.05) 38.78,29.22 38.78,27.23 ; Power.2 25.65,51.44 26.16,50.94 28.89,50.94 31.65,53.69 74.97,53.69 80.01,48.65 80.01,30.57 v1(78.91,29.47)
  Inner2 w1: v1(33.19,27.82) 34.2,26.81 38.35,26.81 39.37,27.82 45.24,27.82 47.04,29.61 v1(52.44,29.61) 52.85,29.61 58.93,35.7 64.26,35.7 65.79,34.17 68.41,34.17 74.25,28.33 77.77,28.33 v1(78.91,29.47)
  Bottom Layer w0.254: C46.1 32.26,27.79 32.74,28.27
  Bottom Layer w1: v1(33.19,27.82) 32.24,28.77 32.24,28.99 ; v1(78.91,29.47) 79.68,29.47 DIODEUSB50.5
5V0-RAW: length 18.4
  Bottom Layer w0.254: 35.6,31.92 35.31,31.63 35.31,28.6 R45.2
  Bottom Layer w0.5: 36.03,32.21 35.74,31.92 34.77,31.92 DIODEREG50.3 ; 36.03,32.21 32.76,32.21 32.24,31.69 DIODEREG50.1 ; 36.03,32.21 36.29,32.47 ; 36.29,32.47 38.81,34.99 38.81,35.44 ; 36.29,32.47 C63.1
5V0_USB: length 15.9
  Top Layer w0.254: v1(75.95,30.55) 75.87,30.48 75.27,30.48 75.16,30.36 74.65,30.36 74.54,30.48 USB1.B4A9 ; v1(75.95,29.33) 75.95,27.31 74.31,25.68 USB1.A4B9
  Bottom Layer w0.254: DIODEUSB50.1 79.69,27.42 78.78,28.33 77.75,28.33 76.75,29.33 v1(75.95,29.33) ; v1(75.95,30.55) v1(75.95,29.33) ; v1(75.95,29.33) 77.79,27.49 DIODEUSB50.3
GND: length 230.2
  Top Layer w0.254: v1(45.47,54.28) 46.69,54.28 LED2.2 ; v1(45.47,54.28) 44.25,54.28 LED3.2 ; v1(45.47,54.28) LED1.2 ; v1(27.5,38.49) 27.93,38.05 INA238.9 ; v1(27.5,38.49) 26.93,37.93 INA238.7 ; v1(27.5,38.49) 27.93,38.93 ; BOOT.2 v1(60.6,52.46) ; SW1.4 32.38,52.33 v1(31.75,52.97) 32.38,53.6 SW1.3 ; C20.1 43.79,32.45 v1(43.79,31.81) ; C20.1 43.35,32.98 42.87,33.45 42.38,33.45 v1(41.91,33.92) 41.78,34.05 41.78,34.54 ; C20.1 44.1,33.65 R48.1 ; U4.29 50.56,42.29 51.56,41.28 v1(51.56,40.79) ; U3.3 62,24.02 61.2,24.82 U3.48 58.95,24.27 v1(57.15,24.27) v1(54.36,24.27) DIODE33.2 ; C38.1 49.26,27.84 v1(51.31,25.79) ; 27.93,38.93 28.43,39.43 INA238.1 ; 27.93,38.93 27.93,40.51 ; U4.3 56.89,39.79 56.09,38.99 U4.48 v1(56.94,36.44) C48.2 ; ESP1.1 47.76,7.5 v1(47.75,7.5) ; U4.14 55.59,46.74 v1(55.41,46.92) 55.02,46.92 ; v1(34.8,7.5) 34.79,7.5 ESP1.40 ; U4.19 53.09,46.49 53.52,46.92 55.02,46.92 ; v1(69.21,25.79) 69.21,23.89 R18.2 ; v1(69.21,25.79) 69.03,25.97 69.03,25.99 68.7,26.32 U3.16 ; v1(69.21,25.79) 68.74,25.32 U3.14 ; USB1.B1A12 72.12,32.99 RJ2.14 ; 41.78,34.54 U2.10 ; 41.78,34.54 41.53,34.54 R3.1 ; 55.02,46.92 54.59,46.49 U4.16 ; U3.29 64.5,30.36 63.17,29.03 v1(62.5,29.03) ; v1(43.79,29) 43.79,28.21 44.43,27.57 ; USB1.A1B12 74.36,24.88 74.65,24.58 75.25,24.58 75.95,25.28 v1(75.95,25.87) ; U3.19 66.55,27.82 v1(66.55,27.82) ; MOTOR_DRV1.10 12.38,22 13.21,22.83 13.21,22.87 13.46,23.13 14.19,23.13 12.72,21.66 MOTOR_DRV1.11 ; v1(31.1,40.92) 31.1,42.18 RESET.1 ; C25.1 69.85,30.87 69.34,31.38 v1(69.09,31.38) ; U3.9 65,22 67.27,19.73 J1.8 ; R7.2 70.87,27.58 v1(70.87,28.58) 70.87,29.08 R8.2 ; REG50.15 35.14,27.94 REG50.8 ; 27.93,40.51 26.09,40.51 C17.1 ; 27.93,40.51 INA238.2 ; C36.1 48.35,46.36 v1(47.5,46.36) 46.89,46.36 U2.15 U2.17 ; C16.1 20.32,22.23 18.8,20.71 17.77,20.71 MOTOR_DRV1.20 17.22,21.66 16.39,22.49 v1(16,22.49) ; v1(56.13,42.55) 56.37,42.79 U4.9 57.61,42.81 C51.2 ; U4.23 51.09,44.37 v1(51.05,44.33) ; v1(66.29,30.11) 66.58,29.82 U3.23 ; MOTOR_DRV1.40 12.72,26.5 MOTOR_DRV1.41 16.72,26 MOTOR_DRV1.32
  Top Layer w0.5: DIODE33.2 54.36,28.33 54.86,28.84 54.86,29.82 C62.2 ; REG50.1 29.92,31.84 v1(29.46,31.38) 29.66,31.19 REG50.2 ; BIG2.2 5.12,22.49 7.13,22.49 v1(7.64,21.98)
  Bottom Layer w0.254: C31.1 68.33,42.64 v1(68.33,43.32) ; C40.2 66.38,27.99 v1(66.55,27.82) ; C52.2 62.79,22.31 65.96,22.31 67.43,20.84 J1.8 ; v1(35.64,41.28) 35.6,41.25 MICRO-SD.6 ; U12.7 U12.6 38.84,18.92 C57.2 38.8,17.62 v1(35.88,17.62) 35.85,17.62 35.81,17.66 35.81,18.66 C56.2 ; C44.2 31.96,26.53 v1(32.26,26.23) C46.2 ; v1(70.87,28.58) 69.87,29.58 C24.1 ; v1(47.75,7.5) 45.03,7.5 C18.1 ; REG33.1 51.39,25.71 v1(51.31,25.79) ; U11.5 7.21,37.35 v1(7.88,38.02) ; v1(7.88,38.02) 7.88,38.73 6.73,39.89 U11.7 ; v1(7.88,38.02) 7.29,38.62 U11.6 ; v1(7.88,38.02) 8.56,37.35 U11.4 ; DIODEREG50.2 33.19,30.31 v1(33.1,30.23) ; v1(14.97,23.13) 14.51,23.59 C58.2 ; C43.1 v1(39.62,29.09) ; CAP_USB_N.1 v1(57.15,20.43) ; U10.8 65.15,10.68 v1(64.51,10.04) 63.88,9.41 U10.2 ; C10.1 v1(75.95,25.87) 78.05,25.87 78.74,26.55 DIODEUSB50.2 ; v1(50.87,32.66) 50.03,32.66 48.09,34.59 C41.2 ; U13.5 45.05,23.09 43.84,21.88 42.93,21.88 41.51,20.46 v1(41.15,20.46) 40.97,20.64 39.97,20.64 ; R37.2 51.57,40.78 v1(51.56,40.79) ; C15.2 v1(13.22,31.12) ; v1(57.15,24.27) 57.15,24.26 CAP_USB_P.1 ; R46.1 v1(39.88,26.81) ; v1(42.26,16.62) 43.1,17.45 U13.13 ; v1(27.5,38.49) 27.85,38.85 C9.1 ; v1(43.79,31.81) 43.79,30.31 43.8,30.3 43.79,30.3 v1(43.79,29) ; v1(31.75,52.97) 31.1,52.32 MICRO-SD.11 ; C55.2 62.5,16.37 63.25,15.63 v1(63.75,15.63) ; v1(33.53,33.41) C63.2
  vias: v1(13.65,25.66) v1(14.67,25.66) v1(15.28,24.25) v1(15.89,25.66) v1(16.51,24.77) v1(16.51,23.61) v1(20.32,19.44) v1(21.08,18.68) v1(21.28,19.48) v1(21.84,17.92) v1(22.1,18.68) v1(22.35,19.44) v1(22.76,17.92) v1(22.86,18.68) v1(32.27,30.23) v1(34.09,30.23) v1(42.26,15.22) v1(42.26,13.82) v1(43.66,16.62) v1(43.66,15.22) v1(43.66,13.82) v1(45.06,16.62) v1(45.06,15.22) v1(45.06,13.82) v1(45.78,40.92) v1(46.48,51.19) v1(57.47,32.65)
VIN: length 74.9
  Top Layer w0.254: 28.7,30.11 28.7,34.36 27.43,35.63 INA238.8
  Top Layer w0.5: 30.1,30.11 28.7,30.11 27.94,29.35 v1(27.94,27.06) ; 30.1,30.11 REG50.4 ; 30.1,30.11 30.32,30.33 REG50.3 ; RPPMOSFET.3 28,23.94 v1(28,24.55)
  Bottom Layer w0.254: C58.1 8.18,24.43 BIG2.1 ; v1(5.86,27.31) 5.86,27.81 3.3,30.36 3.3,41.79 15.49,53.98 26.92,53.98 Power.1 ; R47.1 28.21,29.6 v1(28.7,29.6)
  Bottom Layer w0.5: BIG2.1 6.6,24.77 5.86,25.52 v1(5.86,27.31) ; v1(27.94,27.06) 27.94,24.6 v1(28,24.55)
  vias: v1(4.58,13.73) v1(4.58,12.57) v1(5.84,13.73) v1(5.84,12.61) v1(7.11,13.73) v1(7.11,12.58) v1(14.92,13.78) v1(14.99,12.58) v1(15.98,13.78) v1(15.98,12.58) v1(17.26,13.78) v1(17.26,12.58) v1(24.38,21.3) v1(24.38,5.22) v1(24.35,3.95) v1(24.35,2.71) v1(24.35,1.53) v1(24.57,20.31) v1(24.57,19.21) v1(24.57,18.02) v1(24.76,15.65) v1(25.65,21.22) v1(25.69,20.31) v1(25.65,5.22) v1(25.65,3.95) v1(25.65,2.62) v1(25.65,1.53) v1(25.91,19.09) v1(26.68,20.31) v1(26.67,18.17) v1(26.8,21.22) v1(26.92,5.22) v1(26.92,3.95) v1(26.92,2.6) v1(26.92,1.66) v1(27.69,20.31) v1(27.69,19.29) v1(27.69,18.32) v1(27.69,16.65) v1(28.1,21.22) v1(28.45,17.41) v1(28.96,20.46) v1(28.96,19.52) v1(28.96,18.36)
ACTLED_0: length 29.4
  Top Layer w0.254: v1(66.29,33.16) 66.14,33.16 65.5,32.52 U3.27
  Inner2 w0.254: v1(66.29,33.16) 66.8,33.16 67.89,32.06 67.89,26.28 68.87,25.31 68.87,15.67 66.29,13.09 66.29,9.79 v1(67.06,9.03)
  Bottom Layer w0.254: R76.1 v1(67.06,9.03)
ACTLED_1: length 23.9
  Top Layer w0.254: R78.2 v1(61.21,37.98) ; U4.27 47.02,43.29 v1(46.99,43.32)
  Bottom Layer w0.254: v1(61.21,37.98) 59.09,35.85 56.48,35.85 56.16,36.18 50.25,36.18 49.84,36.6 49.84,40.47 v1(46.99,43.32)
CAL_M: length 26.5
  Top Layer w0.254: MOTOR_DRV1.31 18.03,28.07 v1(18.03,28.08) ; v1(35.41,37.78) 35.43,37.75 U2.5
  Inner2 w0.254: v1(18.03,28.08) 19.05,28.08 20.22,29.24 20.22,32.54 21.7,34.02 29.22,34.02 33.56,38.36 34.82,38.36 v1(35.41,37.78)
CS-SD: length 21.2
  Top Layer w0.254: 45.34,25.29 45.34,25.61 46.99,27.26 v1(46.99,32.14) 46.99,33.92 46.28,34.62 46.28,37.68 44.97,39 v1(40.13,39)
  Bottom Layer w0.254: MICRO-SD.2 40.13,39.94 v1(40.13,39)
CS_ENCODER: length 2.1
  Top Layer w0.254: v1(41.61,24.03) 41.53,24.11 41.53,25.29
  Bottom Layer w0.254: v1(41.61,24.03) 41.64,24 U13.1
CS_MDRV: length 20.3
  Top Layer w0.254: 36.45,25.29 36.45,24.39 v1(36.32,24.27) ; v1(31.5,24.27) 31.03,24.27 29.1,26.2 19,26.2 18.81,26 MOTOR_DRV1.29
  Bottom Layer w0.254: v1(31.5,24.27) v1(36.32,24.27)
CS_W5500_0: length 23.6
  Top Layer w0.254: U3.32 63,32.98 v1(63.17,33.15) ; v1(52.07,18.68) 51.82,18.93 50.91,18.93
  Inner2 w0.254: v1(52.07,18.68) 53.59,18.68 64.41,29.5 64.41,31.91 v1(63.17,33.15)
CS_W5500_1: length 38.2
  Top Layer w0.254: U4.32 50.05,40.79 v1(50.29,41.03) ; ESP1.8 v1(49.53,16.39)
  Inner2 w0.254: v1(50.29,41.03) 50.29,38.71 v1(53.4,35.6) ; v1(49.53,16.39) 49.28,16.39 48.62,17.05 48.62,20.24 59.89,31.51 v1(59.89,32.01)
  Bottom Layer w0.254: v1(59.89,32.01) 57.11,34.78 55.72,34.78 55.16,35.34 53.65,35.34 v1(53.4,35.6)
ENABLE_M: length 24.3
  Top Layer w0.254: v1(18.54,27.06) 18.53,27.06 MOTOR_DRV1.30 ; U2.4 34.17,36.23 v1(34.17,37.78)
  Inner2 w0.254: v1(34.17,37.78) 33.48,37.78 29.37,33.66 21.84,33.66 20.57,32.39 20.57,29.09 v1(18.54,27.06)
ETHERNET_INT_0: length 28.6
  Top Layer w0.254: v1(60.72,33.07) 61,32.79 U3.36 ; ESP1.9 52.06,17.66 v1(52.07,17.66)
  Inner2 w0.254: v1(60.72,33.07) 62.08,34.43 62.74,34.43 64.77,32.39 64.77,29.35 53.08,17.66 v1(52.07,17.66)
ETHERNET_INT_1: length 37.5
  Top Layer w0.254: v1(48.8,38.01) 48.8,38.5 U4.36 ; ESP1.7 49.6,15.12 v1(49.53,15.19)
  Inner2 w0.254: v1(52.32,35.6) 52.32,36.17 50.48,38.01 v1(48.8,38.01) ; v1(49.53,15.19) 48.26,16.46 48.26,20.39 59.18,31.31 v1(59.18,31.63)
  Bottom Layer w0.254: v1(59.18,31.63) 59.18,32.14 56.9,34.43 55.57,34.43 55.01,34.99 53.12,34.99 52.52,35.6 v1(52.32,35.6)
ETHERNET_RESET_0: length 28.8
  Top Layer w0.254: R19.1 36.58,35.19 ; 36.58,35.19 36.7,35.31 U2.6 ; 36.58,35.19 v1(35.81,34.43) ; U3.37 56.69,30.32 v1(56.64,30.36)
  Inner2 w0.254: v1(35.81,34.43) 39.37,30.87 v1(52.58,30.87)
  Bottom Layer w0.254: v1(52.58,30.87) 53.09,30.36 v1(56.64,30.36)
ETHERNET_RESET_1: length 17.6
  Top Layer w0.254: U2.7 37.97,35.57 39.03,34.52 v1(39.93,34.52) 39.32,33.91 R36.1 ; U4.37 50.59,37.01 v1(50.42,36.84)
  Inner2 w0.254: v1(39.93,34.52) 42.19,34.52 42.61,34.93 48.51,34.93 v1(50.42,36.84)
I2C-SCL: length 73.2
  Top Layer w0.254: v1(39.37,21.73) 39.7,22.06 40.37,22.06 41.03,21.4 42.35,21.4 43.34,22.39 43.34,24.75 42.8,25.29 42.8,26.17 43.3,26.67 45.33,26.67 45.97,27.31 45.97,33.92 44.32,35.57 U2.12 44.32,37.6 v1(44.2,37.73) ; INA238.5 26.43,42.65 v1(25.89,43.19) 25.89,43.59 23.01,46.47 23.01,46.97 I2C.1
  Inner2 w0.254: v1(25.89,43.19) 26.04,43.19 29.62,39.61 41.05,39.61 42.68,37.98 43.94,37.98 v1(44.2,37.73)
  Bottom Layer w0.254: v1(25.89,43.19) 25.91,43.21 R6.1 ; v1(39.37,21.73) 38.79,21.15 U12.13 ; U11.2 9.78,39.89 9.33,40.34 9.33,41.39 9.73,41.79 10.67,41.79 16.1,47.23 19.15,47.23 20.83,48.9 I2C.1
I2C-SDA: length 69.9
  Top Layer w0.254: I2C.2 23.37,46.62 26.8,43.19 v1(26.92,43.19) 26.93,43.18 INA238.4 ; v1(40.13,21.47) 40.56,21.05 42.76,21.05 44.07,22.36 44.07,25.92 44.47,26.32 45.48,26.32 46.33,27.17 46.33,34.07 45.59,34.8 45.59,37.55 v1(45.41,37.73)
  Inner2 w0.254: v1(45.41,37.73) 45.02,37.73 44.41,38.34 42.82,38.34 41.2,39.96 29.77,39.96 26.92,42.81 v1(26.92,43.19)
  Bottom Layer w0.254: R5.1 v1(26.92,43.19) ; I2C.2 21.08,46.87 16.29,46.87 U11.1 ; U12.14 39.36,20.81 40.02,21.47 v1(40.13,21.47)
IMU_INT1: length 9
  Top Layer w0.254: v1(34.8,17.66) 34.79,17.66 ESP1.32
  Bottom Layer w0.254: v1(34.8,17.66) 35.56,16.9 39.62,16.9 40.13,17.41 40.13,18.98 39.97,19.14
IMU_INT2: length 4.5
  Top Layer w0.254: 33.41,18.93 34.79,18.93 v1(34.8,18.93)
  Bottom Layer w0.254: v1(34.8,18.93) 35.5,19.64 U12.9
IN_MHIGH_A: length 36
  Top Layer w0.254: ESP1.35 35.56,13.85 v1(36.83,15.12) ; MOTOR_DRV1.34 15.83,27.36 15.83,27.77 16.4,28.34 v1(16.4,28.52)
  Inner2 w0.254: v1(36.83,15.12) 37.34,15.63 37.34,20.32 31.46,26.2 17.37,26.2 16.4,27.17 v1(16.4,28.52)
IN_MHIGH_B: length 34.8
  Top Layer w0.254: v1(35.05,15.04) 34.98,15.12 ESP1.34 ; MOTOR_DRV1.36 14.72,28.36 v1(14.83,28.47)
  Inner2 w0.254: v1(14.83,28.47) 14.83,28.23 17.21,25.85 31.31,25.85 36.93,20.23 36.93,16.49 35.56,15.12 35.13,15.12 v1(35.05,15.04)
IN_MHIGH_C: length 34.9
  Top Layer w0.254: MOTOR_DRV1.38 13.72,28.01 v1(13.15,28.58) ; v1(35.05,16.37) 35.03,16.39 ESP1.33
  Inner2 w0.254: v1(13.15,28.58) 13.22,28.58 13.98,27.82 14.73,27.82 17.06,25.49 31.16,25.49 36.58,20.08 36.58,17.15 35.81,16.39 35.08,16.39 v1(35.05,16.37)
IN_MLOW_A: length 43.6
  Top Layer w0.254: v1(30.38,44.7) 30.38,46.31 U2.28 ; MOTOR_DRV1.35 15.33,27.36 15.33,27.78 15.59,28.04 v1(15.59,28.61)
  Inner2 w0.254: v1(15.59,28.61) 14.68,29.52 9.21,29.52 7.11,31.62 7.11,34.68 11.73,39.3 18.33,39.3 23.96,44.93 29.63,44.93 29.85,44.7 v1(30.38,44.7)
IN_MLOW_B: length 44.4
  Top Layer w0.254: v1(13.91,28.72) 14.22,28.41 MOTOR_DRV1.37 ; U2.27 31.62,44.73 v1(31.64,44.7)
  Inner2 w0.254: v1(13.91,28.72) 13.46,29.17 9.06,29.17 6.71,31.53 6.71,34.78 11.58,39.66 18.19,39.66 23.82,45.29 30.62,45.29 31.21,44.7 v1(31.64,44.7)
IN_MLOW_C: length 45.4
  Top Layer w0.254: U2.26 32.93,46.31 v1(32.93,44.7) ; v1(12.19,28.33) 12.59,27.93 12.95,27.93 13.22,27.66 MOTOR_DRV1.39
  Inner2 w0.254: v1(32.93,44.7) 32.47,44.7 31.53,45.64 23.66,45.64 18.03,40.01 11.43,40.01 6.35,34.93 6.35,31.38 9.4,28.33 v1(12.19,28.33)
INA-ALERT: length 10.6
  Top Layer w0.254: INA238.3 27.43,42.7 v1(27.92,43.19) 28.29,43.19 30.35,41.13 U2.1
  Bottom Layer w0.254: R2.1 27.94,43.21 v1(27.92,43.19)
LINKLED_0: length 30
  Top Layer w0.254: U3.25 66.87,31.82 v1(67.31,31.38)
  Inner2 w0.254: v1(67.31,31.38) 67.31,26.3 68.51,25.1 68.51,15.81 66.55,13.85 63.64,13.85 v1(58.93,9.14)
  Bottom Layer w0.254: R75.1 v1(58.93,9.14)
LINKLED_1: length 16.5
  Top Layer w0.254: v1(49.28,45.09) 49.09,44.91 U4.25 ; v1(62.56,49.16) R77.1
  Bottom Layer w0.254: v1(49.28,45.09) 51.05,45.09 53.48,47.52 60.92,47.52 v1(62.56,49.16)
NFAULT_M: length 25.5
  Top Layer w0.254: MOTOR_DRV1.25 19.15,24 v1(19.23,24.09) ; v1(31.5,33.92) 32.33,33.92 32.89,34.48 U2.3
  Inner2 w0.254: v1(26.98,24.55) 26.75,24.32 22.61,24.32 22.37,24.09 v1(19.23,24.09)
  Bottom Layer w0.254: v1(26.98,24.55) 27.28,24.85 27.28,32.5 28.7,33.92 v1(31.5,33.92)
RXN_0: length 2.6
  Top Layer w0.254: U3.5 63,21.97 v1(63.25,21.73)
  Bottom Layer w0.254: v1(63.25,21.73) 63.25,21.21 R72.1
RXN_1: length 1.4
  Top Layer w0.254: R63.1 58.93,40.79 U4.5
RXP_0: length 3
  Top Layer w0.254: v1(64.01,21.73) 63.83,21.9 63.83,21.97 63.5,22.29 U3.6
  Bottom Layer w0.254: R71.1 64.52,21.22 v1(64.01,21.73)
RXP_1: length 1.6
  Top Layer w0.254: R62.1 58.79,41.79 58.29,41.28 57.59,41.28 U4.6
SD-CD: length 4.5
  Top Layer w0.254: v1(31.5,37.98) 31.5,36.35 U2.2
  Bottom Layer w0.254: MICRO-SD.9 32.3,38.27 R38.1 31.75,38.24 v1(31.5,37.98)
SOA_M: length 41.4
  Top Layer w0.254: MOTOR_DRV1.23 18.9,23 v1(19.04,22.86) ; ESP1.6 49.58,13.85 v1(49.53,13.8)
  Inner2 w0.254: v1(19.04,22.86) 20.2,22.86 20.73,22.34 21.13,22.34 22.75,23.96 28.49,23.96 32,20.45 32,15.88 34.8,13.09 48.82,13.09 v1(49.53,13.8)
SOB_M: length 41.1
  Top Layer w0.254: ESP1.5 49.53,12.58 v1(49.53,12.58) ; MOTOR_DRV1.22 18.08,22.39 18.51,22.39 18.66,22.23 v1(19.5,22.23)
  Inner2 w0.254: v1(19.5,22.23) 19.75,21.98 21.27,21.98 22.9,23.61 28.34,23.61 31.5,20.46 31.5,15.88 34.79,12.58 v1(49.53,12.58)
SOC_M: length 41.2
  Top Layer w0.254: ESP1.4 49.54,11.31 v1(49.53,11.3) ; v1(18.8,21.6) 18.39,22 MOTOR_DRV1.21
  Inner2 w0.254: 49.28,11.31 48.51,12.07 34.8,12.07 30.99,15.88 30.99,20.46 28.19,23.25 23.05,23.25 21.4,21.6 v1(18.8,21.6)
SPI_CLK_0: length 45.6
  Top Layer w0.254: v1(42.15,26.49) 40.84,26.49 40.26,25.92 40.26,24.39 39.37,23.5 v1(35.81,23.5) ; v1(31.75,23.5) 31.57,23.68 31.11,23.68 28.95,25.84 19.15,25.84 18.81,25.5 MOTOR_DRV1.28
  Inner2 w0.254: v1(37.59,13.85) 34.8,13.85 32.36,16.29 32.36,20.6 31.75,21.21 v1(31.75,23.5)
  Bottom Layer w0.254: v1(37.59,13.85) 38.1,14.36 38.61,14.36 NOREF#2.1 ; v1(42.15,26.49) 43.1,25.54 U13.2 ; v1(31.75,23.5) v1(35.81,23.5)
SPI_CLK_1: length 54.5
  Top Layer w0.254: U3.33 62.5,33.56 v1(62.55,33.61) 61.15,35.01 51.42,35.01 49.78,36.65 49.78,37.68 50.55,38.44 50.55,39.86 50.12,40.29 U4.33 48.22,40.29 48.2,40.27 v1(47.57,40.27) ; ESP1.12 52.06,21.47 v1(52.07,21.47) ; v1(44.2,40.78) 43.69,41.28 v1(36.83,41.28)
  Inner2 w0.254: v1(52.07,21.47) 55.37,21.47 61.72,27.82 61.72,32.77 v1(62.55,33.61) ; v1(47.57,40.27) 44.7,40.27 v1(44.2,40.78)
  Bottom Layer w0.254: MICRO-SD.5 36.7,41.16 v1(36.83,41.28)
SPI_MISO_0: length 49.2
  Top Layer w0.254: MOTOR_DRV1.26 18.82,24.5 19.07,24.76 20.2,24.76 20.58,25.13 28.66,25.13 30.02,23.76 v1(30.02,23.26) ; v1(40.13,11.06) 40.79,11.72 40.79,14.21 40.56,14.44 40.56,15.36 41.48,16.28 v1(41.48,17.66) ; v1(38.97,24.27) 38.99,24.29 38.99,25.29
  Inner2 w0.254: v1(41.48,17.66) 41.48,17.69 38.35,20.82 38.35,21.82 38.98,22.45 38.98,23.11 38.76,23.34 38.76,23.91 38.97,24.12 v1(38.97,24.27)
  Bottom Layer w0.254: v1(40.13,11.06) 39.62,10.55 NOREF#3.2 ; v1(30.02,23.26) 30.02,23.13 30.75,22.41 35.35,22.41 ; 35.35,22.41 37.12,22.41 v1(38.97,24.27) 40.13,24.27 41.66,22.74 43.43,22.74 43.75,23.06 U13.3 ; 35.35,22.41 35.38,22.38 R10.2
SPI_MISO_1: length 56.3
  Top Layer w0.254: v1(62.48,30.45) 62.48,30.64 62,31.12 U3.34 62,33.12 60.47,34.66 51.27,34.66 49.43,36.5 49.43,37.93 50.19,38.69 50.19,39.39 49.88,39.7 49.18,39.7 U4.34 47.92,39.79 47.64,39.51 v1(47.57,39.51) ; v1(52.07,20.2) 52.06,20.2 ESP1.11
  Inner2 w0.254: v1(34.8,41.79) 34.87,41.87 41.07,41.87 43.43,39.51 v1(47.57,39.51) ; v1(52.07,20.2) 54.61,20.2 63.08,28.68 63.08,29.85 v1(62.48,30.45)
  Bottom Layer w0.254: MICRO-SD.7 34.5,41.5 v1(34.8,41.79)
SPI_MOSI_0: length 44.7
  Top Layer w0.254: v1(30.99,23) 30.61,23.38 30.61,23.68 28.8,25.49 19.3,25.49 18.82,25 MOTOR_DRV1.27 ; v1(40.64,16.9) 40.13,16.39 v1(40.13,13.8) ; 37.72,25.29 37.78,25.23 v1(37.78,24.27)
  Inner2 w0.254: v1(37.78,24.27) 38.1,24.27 38.4,23.97 v1(38.4,22.87) 37.85,22.32 37.85,20.82 39.22,19.45 39.22,18.32 v1(40.64,16.9)
  Bottom Layer w0.254: v1(37.78,24.27) 36.43,22.92 31.06,22.92 v1(30.99,23) ; U13.4 44.4,22.95 43.69,22.23 40.2,22.23 39.87,22.56 38.71,22.56 v1(38.4,22.87) ; v1(40.13,13.8) 38.91,12.58 NOREF#4.3
SPI_MOSI_1: length 45.1
  Top Layer w0.254: U3.35 61.5,33.12 60.45,34.17 60.25,34.17 v1(60.15,34.07) 59.92,34.3 51.04,34.3 48.46,36.88 48.46,37.52 47.71,38.27 v1(47.71,38.74) 47.85,38.74 48.39,39.29 U4.35 ; v1(46.21,38.74) 47.75,37.2 47.75,31.89 47.35,31.48 47.35,27.11 46.61,26.38 46.61,25.29
  Bottom Layer w0.254: MICRO-SD.3 38.9,40.82 39.37,41.28 42.16,41.28 44.7,38.74 v1(46.21,38.74) v1(47.71,38.74)
TEMP-OS: length 32.3
  Top Layer w0.254: v1(37.85,38.24) 38.35,38.24 39.24,37.35 U2.8
  Inner2 w0.254: v1(37.85,38.24) 36.83,39.25 18.8,39.25 18.49,38.95 13.95,38.95 v1(12.45,37.44)
  Bottom Layer w0.254: U11.3 10.71,38.49 R79.2 12.2,37.69 v1(12.45,37.44)
TXN_0: length 2.3
  Top Layer w0.254: v1(60.45,22.23) 61,22.79 U3.1
  Bottom Layer w0.254: v1(60.45,22.23) 59.94,21.73 R70.1
TXN_1: length 1.4
  Top Layer w0.254: R61.1 58.9,38.79 U4.1
TXP_0: length 2.2
  Top Layer w0.254: v1(61.47,21.98) 61.5,22.02 U3.2
  Bottom Layer w0.254: v1(61.47,21.98) 61.47,21.46 R69.1
TXP_1: length 1.5
  Top Layer w0.254: R60.1 58.47,39.29 U4.2
USB_NEG: length 25.6
  Top Layer w0.254: USB1.B7 72.92,27.33 v1(72.39,27.85) 72.86,28.33 USB1.A7
  Bottom Layer w0.254: R11.1 54.62,21.75 CAP_USB_N.2 57.68,21.75 59.69,23.76 71.63,23.76 72.39,24.52 v1(72.39,27.85)
USB_POS: length 26
  Top Layer w0.254: v1(72.39,28.84) 72.4,28.83 USB1.B6 73.91,28.75 74.53,28.75 74.69,28.59 74.69,28.06 74.53,27.9 73.91,27.9 USB1.A6
  Bottom Layer w0.254: R14.1 54.62,22.98 CAP_USB_P.2 57.24,23.06 58.21,23.06 59.41,24.27 71.12,24.27 71.63,24.77 71.63,28.08 v1(72.39,28.84)
$1N21: length 19.8
  Top Layer w0.254: v1(28.19,35.7) 28.43,35.93 INA238.10
  Bottom Layer w0.254: R16.2 19.29,20.44 20.44,21.59 20.44,23.3 21.34,24.2 SHUNTPWR.1 ; v1(28.19,35.7) 16.25,35.7 PWR.1
$1N28: length 1.7
  Top Layer w0.254: USB1.B5 72.15,29.83 R8.1
$1N29: length 1.7
  Top Layer w0.254: R7.1 73.82,26.81 USB1.A5
$1N46: length 15.6
  Top Layer w0.254: v1(57.33,27.53) 57.33,28.85 54.29,31.89 C39.1
  Top Layer w1: v1(52.89,26.46) 52.89,25.92 DIODE33.1 ; DIODE33.3 55.81,25.91 v1(55.81,26.46)
  Bottom Layer w1: REG33.2 52.24,26.46 v1(52.89,26.46) v1(55.81,26.46) 56.47,26.46 REG33.4
$1N52:
  vias: v1(23.63,31.88) v1(23.63,30.84) v1(23.63,29.86) v1(23.63,28.84) v1(23.63,27.84) v1(23.63,26.79) v1(24.44,26.79) v1(24.47,31.89) v1(24.47,30.87) v1(24.47,29.85) v1(24.47,28.84) v1(24.47,27.82) v1(25.39,31.89) v1(25.39,30.87) v1(25.39,29.85) v1(25.39,28.84) v1(25.39,27.82) v1(25.37,26.79) v1(26.33,31.89) v1(26.33,30.87) v1(26.33,29.85) v1(26.33,28.84) v1(26.33,27.82) v1(26.31,26.79)
$1N53: length 4.5
  Bottom Layer w0.254: v1(22.1,21.39) 20.67,19.96 20.63,19.96 20.56,20.02 20.08,20.02 20.01,19.96 R16.1
$1N3919: length 1.5
  Top Layer w0.254: LED50.1 R3.2
$1N8597: length 2.5
  Top Layer w0.254: REG50.11 37.51,29.89 v1(37.59,29.96)
  Bottom Layer w0.254: v1(37.59,29.96) 37.98,29.96 C42.2
$1N8601: length 11.5
  Top Layer w0.5: REG50.12 36.75,30.54 v1(37.08,30.87) 36.77,31.19 REG50.13
  Inner2 w0.5: v1(43.69,34.17) 42.42,32.9 v1(39.62,32.9)
  Bottom Layer w0.254: C42.1 37.1,30.89
  Bottom Layer w0.5: 37.1,30.89 39.12,32.9 v1(39.62,32.9)
$1N8664: length 2.3
  Top Layer w0.254: REG50.10 37.53,29.24 v1(37.59,29.17)
  Bottom Layer w0.254: C43.2 38.25,29.17 v1(37.59,29.17)
$1N8745: length 4.5
  Top Layer w0.254: v1(38.1,28.08) 37.59,28.59 REG50.9
  Bottom Layer w0.254: R45.1 38.1,27.33 ; 38.1,27.33 v1(38.1,28.08) ; 38.1,27.33 R46.2
$1N8854: length 2.6
  Top Layer w0.254: REG50.5 29.16,29.24 28.94,29.02 28.92,29.02 v1(28.69,28.79)
  Bottom Layer w0.254: R47.2 28.64,28.85 v1(28.69,28.79)
$1N8916: length 2.9
  Top Layer w0.254: REG50.6 30.12,28.39 29.44,28.39 29.08,28.03 v1(28.7,28.03)
  Bottom Layer w0.254: C44.1 28.7,27.33 v1(28.7,28.03)
$1N9309: length 1.5
  Top Layer w0.254: R48.2 LED33.1
$2N19: length 4.9
  Top Layer w0.254: MOTOR_DRV1.33 16.33,27.36 16.33,27.77 16.5,27.93 17,27.93 17.24,28.17 17.24,29.13 16.51,29.85 v1(15.22,29.85)
$2N21: length 4.2
  Top Layer w0.254: MOTOR_DRV1.2 11.47,26 v1(10.67,26.81)
  Bottom Layer w0.254: v1(10.67,26.81) 9.46,28.01 C61.2
$2N22: length 2.8
  Top Layer w0.254: v1(11.18,27.57) 11.97,26.77 MOTOR_DRV1.1
  Bottom Layer w0.254: v1(11.18,27.57) 10.86,27.88 C61.1
$2N24: length 33.4
  Top Layer w0.254: v1(23.54,22.67) 22.91,22.03 22.91,21.35 22.12,20.56 19.66,20.56 19.41,20.3 17.17,20.3 16.72,20.75 MOTOR_DRV1.19 ; MOSFET_C.20 28.68,5.45 30.07,6.84 30.07,16.79 30.3,17.02 30.3,17.57 30.41,17.67 30.41,18.16 30.3,18.26 v1(30.3,18.68)
  Bottom Layer w0.254: v1(23.54,22.67) 29.03,22.67 30.07,21.62 30.07,19.69 30.3,19.47 v1(30.3,18.68)
  vias: v1(29.84,5.44) v1(29.84,4.1) v1(29.84,2.92) v1(29.84,1.64) v1(30.99,5.44) v1(30.99,4.2) v1(30.99,2.95) v1(30.99,1.66)
$2N25: length 21.6
  Top Layer w0.254: MOTOR_DRV1.16 15.22,20.22 16.51,18.93 19.3,18.93 21.34,16.9 22.61,16.9 22.86,16.65 22.86,11.57 22.1,10.8 22.1,6.99 22.6,6.49 23.26,6.49 MOSFET_C.1
$2N26: length 6.6
  Top Layer w0.254: 13.75,17.36 13.01,17.36 v1(12.45,17.92) ; MOTOR_DRV1.15 14.72,19.68 v1(14.55,19.52)
  Inner2 w0.254: v1(14.55,19.52) 14.55,18.75 14.48,18.68 13.21,18.68 v1(12.45,17.92)
$2N27: length 7.7
  Top Layer w0.254: v1(13.79,19.7) 14.22,20.13 14.22,21.25 MOTOR_DRV1.14 ; 13.75,16.86 12.49,16.86 v1(11.68,17.66)
  Inner2 w0.254: v1(11.68,17.66) 11.68,18.68 12.19,19.19 13.28,19.19 v1(13.79,19.7)
$2N28: length 9.4
  Top Layer w0.254: v1(19.07,17.75) 18.91,17.75 18.56,17.4 18.5,17.4 MOSFET_B.22 ; v1(15.49,19.01) 15.42,18.93 13.72,18.93 13.21,19.44 13.21,19.95 13.72,20.46 MOTOR_DRV1.13
  Inner2 w0.254: v1(15.49,19.01) 16.75,17.75 v1(19.07,17.75)
$2N29: length 12.4
  Top Layer w0.254: MOTOR_DRV1.12 13.22,20.47 12.7,19.95 12.7,19.44 13.72,18.42 19.23,18.42 19.81,17.84 19.81,16.65 19.52,16.36 MOSFET_B.20
  vias: v1(19.43,13.77) v1(19.47,12.58) v1(20.54,13.77) v1(20.47,12.58) v1(21.67,13.77) v1(21.67,12.58)
$2N31: length 8.7
  Top Layer w0.254: 8.29,16.42 9.68,16.42 10.92,17.66 10.92,21.86 11.57,22.5 MOTOR_DRV1.9
  vias: v1(8.89,12.58) v1(8.97,13.5) v1(9.2,14.61) v1(10.3,13.5) v1(10.3,12.58) v1(10.41,14.61)
$2N32: length 7.6
  Top Layer w0.254: MOTOR_DRV1.8 11.56,23 10.57,22.01 10.57,19.44 8.55,17.42 MOSFET_A.22
$2N33: length 14.2
  Top Layer w0.254: MOSFET_A.2 3.44,16.9 2.79,16.9 2.29,17.41 2.29,18.42 2.86,19 6.67,19 11.18,23.5 MOTOR_DRV1.7
$2N34: length 13.2
  Top Layer w0.254: v1(3.3,19.69) 6.6,19.69 10.91,24 MOTOR_DRV1.6 ; v1(2.87,17.92) 2.92,17.92 3.37,17.47 3.42,17.47 MOSFET_A.1
  Bottom Layer w0.254: v1(2.87,17.92) 2.87,19.26 v1(3.3,19.69)
$2N47: length 23.1
  Top Layer w0.254: v1(21.57,11.31) 21.57,11.12 21.74,10.95 21.74,6.85 22.64,5.95 MOSFET_C.2 ; v1(23.62,13.34) 23.62,16.39 22.76,17.26 21.49,17.26 19.3,19.44 16.51,19.44 15.72,20.23 MOTOR_DRV1.17
  Inner2 w0.254: v1(21.57,11.31) 21.57,11.65 22.25,12.34 22.62,12.34 v1(23.62,13.34)
$2N48: length 32.2
  Top Layer w0.254: MOTOR_DRV1.18 16.22,20.49 16.76,19.95 19.56,19.95 19.81,20.2 22.35,20.2 23.51,21.36 v1(23.51,21.81) ; MOSFET_C.22 28.66,6.45 29.72,7.5 29.72,17.81 v1(29.82,17.92)
  Bottom Layer w0.254: v1(29.82,17.92) 29.72,18.02 29.72,21.47 28.96,22.23 23.94,22.23 v1(23.51,21.81)
$2N6377: length 4.9
  Top Layer w0.254: v1(8.64,26.81) 9.94,25.5 MOTOR_DRV1.3
  Bottom Layer w0.254: 7.86,27.31 8.13,27.31 v1(8.64,26.81)
$3N13: length 3.6
  Top Layer w0.254: 50.91,24.01 52.33,24.01 v1(52.83,23.5)
  Bottom Layer w0.254: R14.2 53.34,23 v1(52.83,23.5)
$3N14: length 3.6
  Top Layer w0.254: v1(52.58,22.47) 52.32,22.74 ESP1.13
  Bottom Layer w0.254: v1(52.58,22.47) 53.33,21.73 R11.2
$3N15: length 52.8
  Top Layer w0.254: v1(41.15,15.12) 41.15,13.34 44.45,10.04 v1(49.53,10.04) 49.53,10.04 ESP1.3 ; RESET.2 23.63,42.05 C17.2 23.71,40.18 25.15,38.74 25.15,36.97 28.12,33.99 v1(28.12,32.06)
  Inner2 w0.254: v1(28.12,32.06) 28.12,31.7 34.29,25.53 34.29,24.2 35.57,22.92 35.57,22.59 38.86,19.3 38.86,17.41 v1(41.15,15.12)
  Bottom Layer w0.254: R12.1 v1(49.53,10.04)
$3N36: length 51.6
  Top Layer w0.254: 33.41,24.01 33.41,25.27 v1(33.15,25.54) ; v1(51.82,51.19) 51.83,51.2 BOOT.1 50.05,52.46 50.04,52.47
  Inner2 w0.254: v1(51.82,51.19) 51.64,51.01 51.64,44.09 48.29,40.75 48.29,38.35 45.64,35.7 31.91,35.7 29.52,33.31 28.09,33.31 27.53,32.75 27.53,31.79 33.15,26.17 v1(33.15,25.54)
$3N47: length 7.3
  Top Layer w0.254: U2.18 43.05,47.51 43.69,48.14 48.53,48.14 R17.2
$3N65: length 55.3
  Top Layer w0.254: ESP1.37 34.53,11.31 v1(35.05,10.79)
  Inner2 w0.254: UART.2 71.88,7.5 66.55,7.5 65.18,6.13 v1(65.18,5.62) 65.18,4.1 64.67,3.59 55.73,3.59 52.94,6.38 39.45,6.38 v1(35.05,10.79)
  Bottom Layer w0.254: U10.1 65.18,7.45 v1(65.18,5.62)
$3N66: length 57.3
  Top Layer w0.254: v1(36.09,10.57) 34.09,12.58 ESP1.36
  Inner2 w0.254: v1(36.09,10.57) 39.92,6.74 53.09,6.74 55.88,3.95 60.71,3.95 61.21,4.45 v1(61.21,5.72) 64.26,5.72 66.4,7.86 71.73,7.86 76.96,13.09 76.96,15.12 UART.3
  Bottom Layer w0.254: U10.4 61.34,5.85 v1(61.21,5.72)
$3N7389: length 12.6
  Bottom Layer w0.254: U10.7 63.88,13.22 64.68,14.02 67.22,14.02 70.61,17.41 CANBUS.2
$3N7393: length 14.8
  Bottom Layer w0.254: U10.6 62.61,12.88 64.11,14.38 67.07,14.38 72.64,19.95 CANBUS.3
$3N12439: length 1.5
  Top Layer w0.254: R82.2 LED2.1
$3N12443: length 1.5
  Top Layer w0.254: R83.2 LED1.1
$3N12605: length 1.5
  Top Layer w0.254: R84.2 LED3.1
$3N12760: length 5.6
  Top Layer w0.254: ESP1.39 34.79,8.77 v1(34.8,8.77)
  Bottom Layer w0.254: NOREF.1 38.61,8.77 v1(34.8,8.77)
$3N12968: length 14.9
  Top Layer w0.254: MCP_INT.1 53.39,48.85 41.86,48.85 40.51,47.51 U2.20
$3N12972: length 16.6
  Top Layer w0.254: MCP_INT.2 55.69,48.65 54.56,47.52 52.63,47.52 51.65,48.5 43.03,48.5 41.78,47.25 U2.19
$3N18193: length 10.6
  Top Layer w0.254: U2.24 35.57,46.48 R80.1 35.57,49.68 38.23,52.33 SW1.1
